# Altium schematic sheet GSM-LCD-ATmega32.schdoc: GSM-LCD-ATmega32
size A3; Address1: Remote control; Address2: Arduino compatible; Revision: 1.0; SheetNumber: 01; SheetTotal: 01
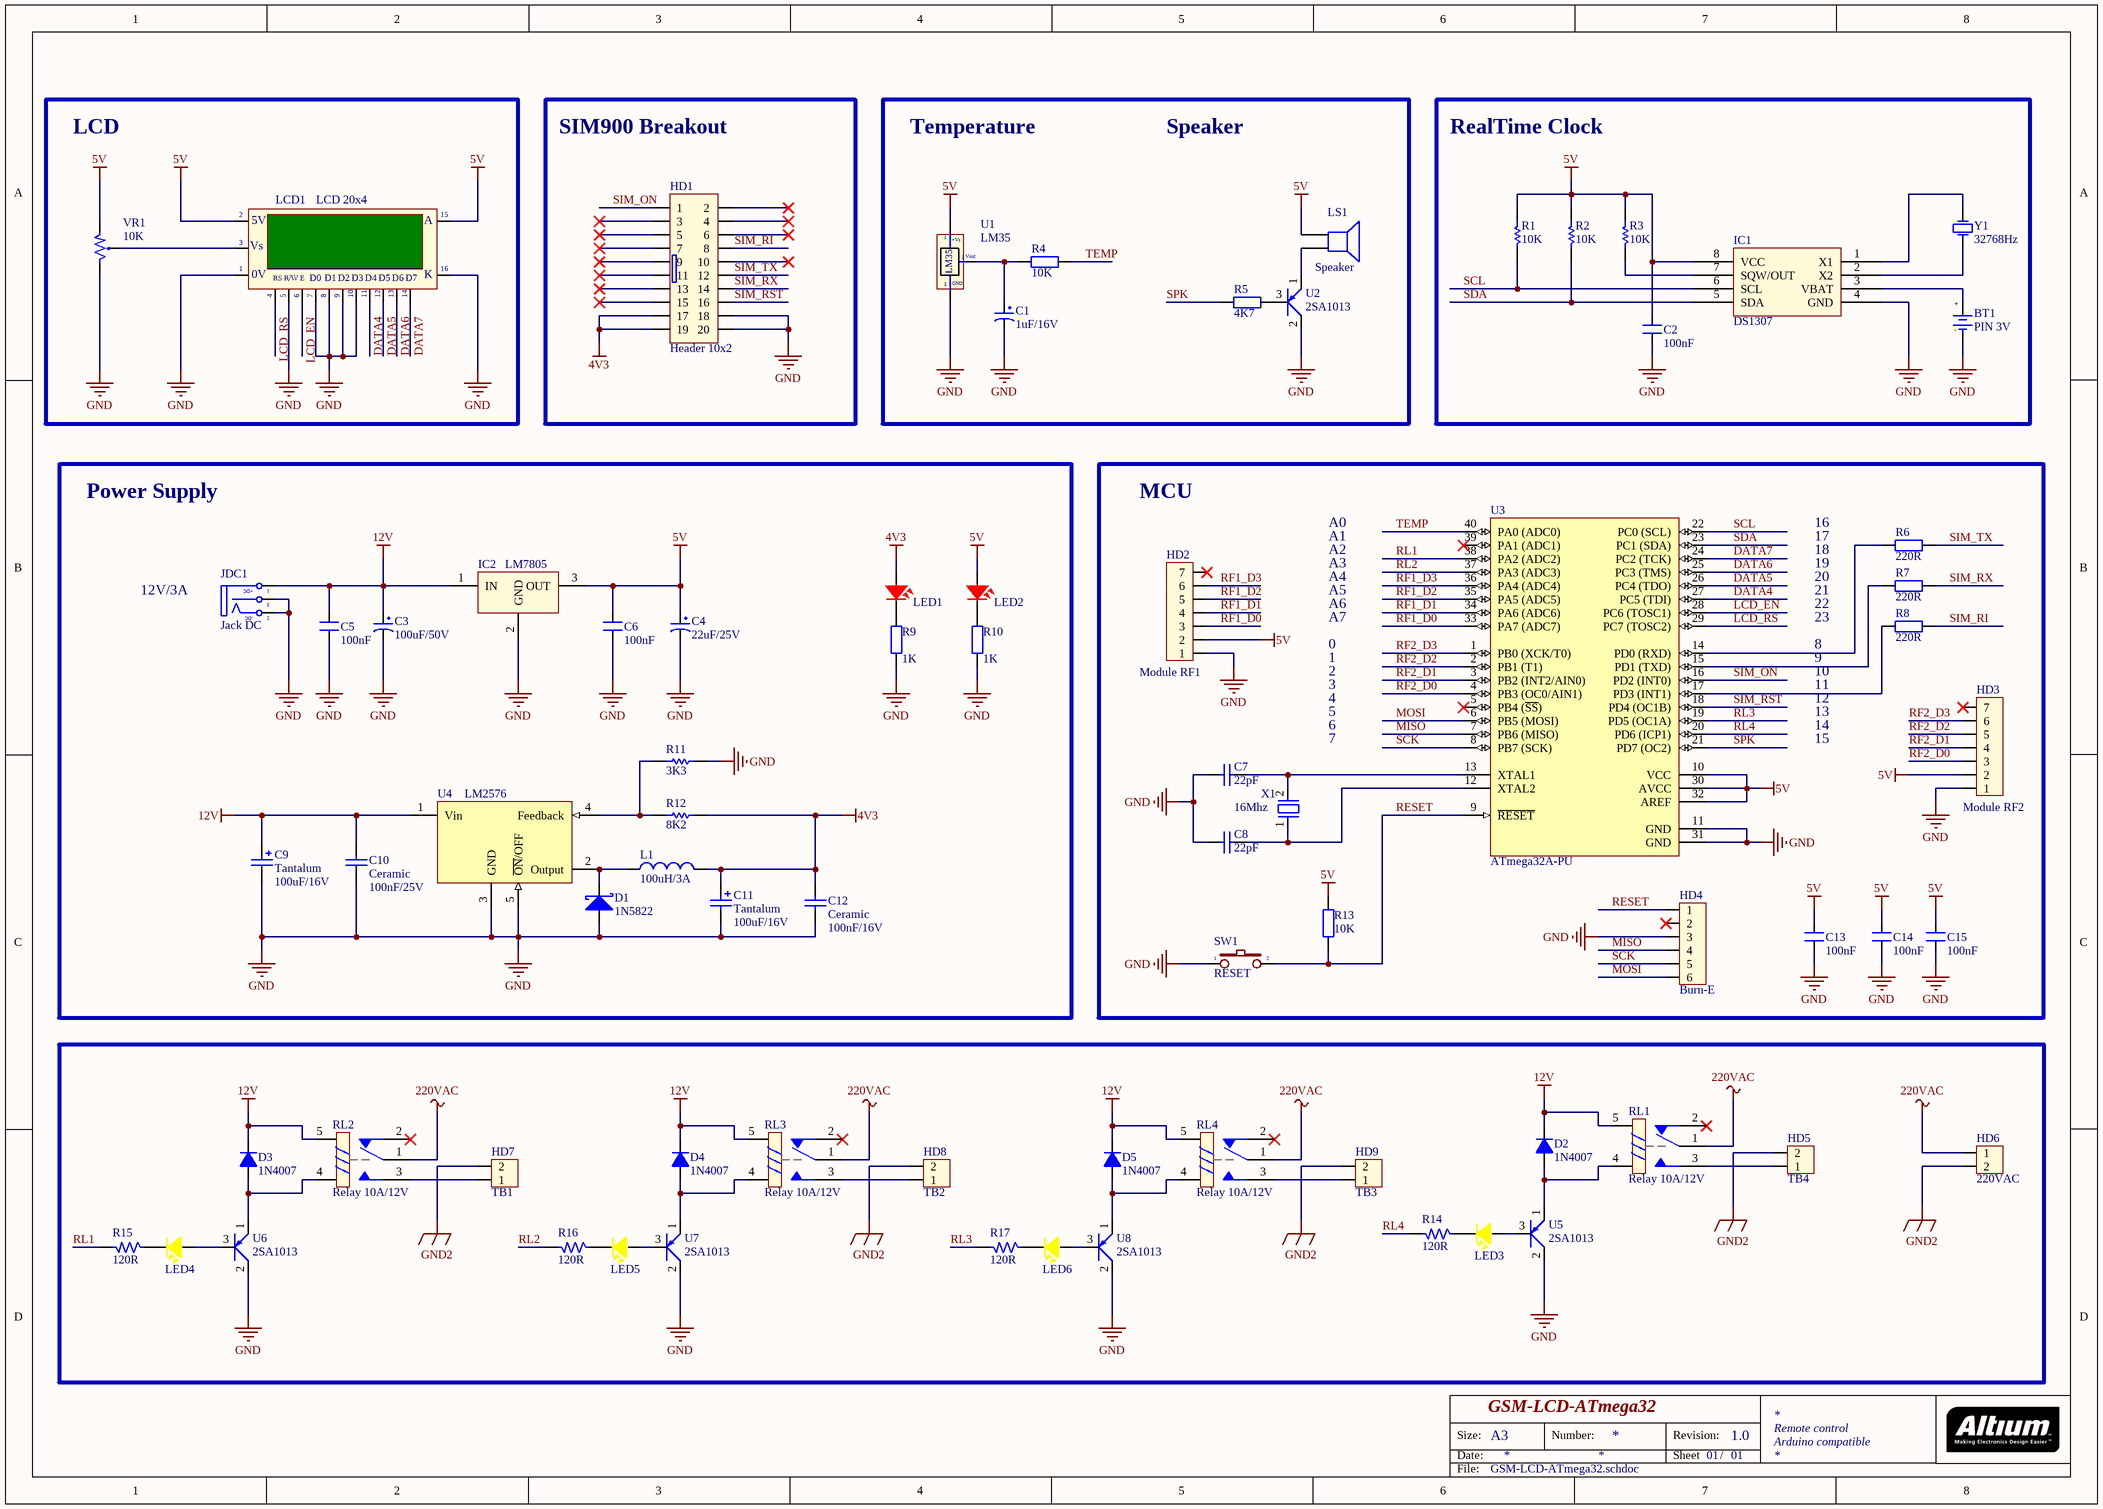
[diagram p0: GSM-LCD-ATmega32.schdoc]

## Parts
BT1  PIN 3V  [PIN3V]
C1  1uF/16V  [CAP_1UF_50V]
C2  100nF  [Tu gom 104]
C3  100uF/50V  [CAP_100UF_50V]
C4  22uF/25V  [CAP_22UF_50V]
C5  100nF  [Tu gom 104]
C6  100nF  [Tu gom 104]
C7  value 22pF  [Tu 33p]  (hidden comment: 5AK102KABAA)
C8  value 22pF  [Tu 33p]  (hidden comment: 5AK102KABAA)
C9  Tantalum  value 100uF/16V  [CAP_100UF_16V]
C10  Ceramic  value 100nF/25V  [Tu gom 104]
C11  Tantalum  value 100uF/16V  [CAP_100UF_16V]
C12  Ceramic  value 100nF/16V  [Tu gom 104]
C13  100nF  [Tu gom 104]
C14  100nF  [Tu gom 104]
C15  100nF  [Tu gom 104]
D1  1N5822  [1N5822]
D2  1N4007  [1N4007]
D3  1N4007  [1N4007]
D4  1N4007  [1N4007]
D5  1N4007  [1N4007]
HD1  Header 10x2  [Female Header_10x2]
HD2  Module RF1  [FM-Header 7]
HD3  Module RF2  [FM-Header 7]
HD4  Burn-E  [CON6]
HD5  TB4  [DOMINO 2_pitch 8.5mm]
HD6  220VAC  [DOMINO 2_pitch 8.5mm]
HD7  TB1  [DOMINO 2_pitch 8.5mm]
HD8  TB2  [DOMINO 2_pitch 8.5mm]
HD9  TB3  [DOMINO 2_pitch 8.5mm]
IC1  DS1307  [DS1307]
IC2  LM7805  [LM7805_TN_S]
JDC1  Jack DC  [JACK DC-IN]
L1  value 100uH/3A  [Inductor 150mH]  (hidden comment: LD26W8-151N)
LCD1  LCD 20x4  [LCD20x4]
LED1  LED-RED  [LED3R]  (value not drawn)
LED2  LED-RED  [LED3R]  (value not drawn)
LED3  LED-YELLOW  [LED3Y]  (value not drawn)
LED4  LED-YELLOW  [LED3Y]  (value not drawn)
LED5  LED-YELLOW  [LED3Y]  (value not drawn)
LED6  LED-YELLOW  [LED3Y]  (value not drawn)
LS1  Speaker  [SPEAKER]
R1  value 10K  [RES 1/4W CFR25]
R2  value 10K  [RES 1/4W CFR25]
R3  value 10K  [RES 1/4W CFR25]
R4  value 10K  [RES 1/4W CFR25]  (hidden comment: Res2)
R5  value 4K7  [RES 1/4W CFR25]  (hidden comment: Res2)
R6  value 220R  [RES 1/4W CFR25]  (hidden comment: Res2)
R7  value 220R  [RES 1/4W CFR25]  (hidden comment: Res2)
R8  value 220R  [RES 1/4W CFR25]  (hidden comment: Res2)
R9  value 1K  [RES 1/4W CFR25]  (hidden comment: Res2)
R10  value 1K  [RES 1/4W CFR25]  (hidden comment: Res2)
R11  value 3K3  [RES 1/4W CFR25]  (hidden comment: CFR25S)
R12  value 8K2  [RES 1/4W CFR25]  (hidden comment: CFR25S)
R13  value 10K  [RES 1/4W CFR25]  (hidden comment: Res2)
R14  120R  [RES 1/4W CFR25]
R15  120R  [RES 1/4W CFR25]
R16  120R  [RES 1/4W CFR25]
R17  120R  [RES 1/4W CFR25]
RL1  Relay 10A/12V  [RL_10A_12V]
RL2  Relay 10A/12V  [RL_10A_12V]
RL3  Relay 10A/12V  [RL_10A_12V]
RL4  Relay 10A/12V  [RL_10A_12V]
SW1  RESET  [BUTTON 2PIN TRON]
U1  LM35  [LM35]
U2  2SA1013  [2SA1013]
U3  ATmega32A-PU  [ATmega32A]
U4  LM2576  [LM2576_DIP]
U5  2SA1013  [2SA1013]
U6  2SA1013  [2SA1013]
U7  2SA1013  [2SA1013]
U8  2SA1013  [2SA1013]
VR1  10K  [VR1]
X1  16Mhz  [CRYSTAL 16Mhz]
Y1  value 32768Hz  [Crystal 32.768 Khz_stand]  (hidden comment: HC49S-20-C-30-30-F-20.000MHz)

## Blocks framed on the sheet
LCD: LCD1 VR1
SIM900 Breakout: HD1
RealTime Clock: BT1 C2 IC1 R1-R3 Y1
Power Supply: C3-C6 C9-C12 D1 IC2 JDC1 L1 LED1 LED2 R9-R12 U4
MCU: C7 C8 C13-C15 HD2-HD4 R6-R8 R13 SW1 U3 X1

## Nets
4V3: C11.1(+) C12.2 HD1.17 HD1.19 L1.2 LED1.1 R12.1
5V: C2.2 C4.1 C6.2 C13.2 C14.2 C15.2 HD2.2 HD3.2 IC1.8(VCC) IC2.3(OUT) LCD1.2(VDD) LCD1.15(A) LED2.1 LS1.2 R1.2 R2.2 R3.2 R13.2 U1.1(+Vs) U3.10(VCC) U3.30(AVCC) U3.32(AREF) VR1.1
12V: C3.1 C5.2 C9.1(+) C10.2 D2.2(K) D3.2(K) D4.2(K) D5.2(K) IC2.1(IN) JDC1.1(T) RL1.5 RL2.5 RL3.5 RL4.5 U4.1(Vin)
220VAC: HD6.1 RL1.1 RL2.1 RL3.1 RL4.1
GND: BT1.2(GND) C1.2 C2.1 C3.2 C4.2 C5.1 C6.1 C7.1 C8.1 C9.2(-) C10.1 C11.2(-) C12.1 C13.1 C14.1 C15.1 D1.1(A) HD1.18 HD1.20 HD2.1 HD3.1 HD4.3 IC1.4(GND) IC2.2(GND) JDC1.2(TN) JDC1.3(S) LCD1.1(GND) LCD1.5(R/~{W}) LCD1.7(D0) LCD1.8(D1) LCD1.9(D2) LCD1.10(D3) LCD1.16(K) R9.1 R10.1 R11.2 SW1.1 U1.3(-) U2.2(C) U3.11(GND) U3.31(GND) U4.3(GND) U4.5(~{ON}/OFF) U5.2(C) U6.2(C) U7.2(C) U8.2(C) VR1.3
GND2: HD5.2 HD6.2 HD7.2 HD8.2 HD9.2
DATA4: LCD1.11(D4) U3.27(PC5_(TDI))
DATA5: LCD1.12(D5) U3.26(PC4_(TDO))
DATA6: LCD1.13(D6) U3.25(PC3_(TMS))
DATA7: LCD1.14(D7) U3.24(PC2_(TCK))
LCD_EN: LCD1.6(~{EN}) U3.28(PC6_(TOSC1))
LCD_RS: LCD1.4(RS) U3.29(PC7_(TOSC2))
MISO: HD4.4 U3.7(PB6_(MISO))
MOSI: HD4.6 U3.6(PB5_(MOSI))
RESET: HD4.1 R13.1 SW1.2 U3.9(~{RESET})
RF1_D0: HD2.3 U3.33(PA7_(ADC7))
RF1_D1: HD2.4 U3.34(PA6_(ADC6))
RF1_D2: HD2.5 U3.35(PA5_(ADC5))
RF1_D3: HD2.6 U3.36(PA4_(ADC4))
RF2_D0: HD3.3 U3.4(PB3_(OC0/AIN1))
RF2_D1: HD3.4 U3.3(PB2_(INT2/AIN0))
RF2_D2: HD3.5 U3.2(PB1_(T1))
RF2_D3: HD3.6 U3.1(PB0_(XCK/T0))
RL1: R15.2 U3.38(PA2_(ADC2))
RL2: R16.2 U3.37(PA3_(ADC3))
RL3: R17.2 U3.19(PD5_(OC1A))
RL4: R14.2 U3.20(PD6_(ICP1))
SCK: HD4.5 U3.8(PB7_(SCK))
SCL: IC1.6(SCL) R1.1 U3.22(PC0_(SCL))
SDA: IC1.5(SDA) R2.1 U3.23(PC1_(SDA))
SIM_ON: HD1.1 U3.16(PD2_(INT0))
SIM_RI: HD1.8 R8.2
SIM_RST: HD1.16 U3.18(PD4_(OC1B))
SIM_RX: HD1.14 R7.2
SIM_TX: HD1.12 R6.2
SPK: R5.1 U3.21(PD7_(OC2))
TEMP: R4.2 U3.40(PA0_(ADC0))
NetBT1_1: BT1.1(+3V) IC1.3(VBAT)
NetC1_1: C1.1 R4.1 U1.2(Vout)
NetC7_2: C7.2 U3.13(XTAL1) X1.2
NetC8_2: C8.2 U3.12(XTAL2) X1.1
NetD1_2: D1.2(K) L1.1 U4.2(Output)
NetD2_1: D2.1(A) RL1.4 U5.1(E)
NetD3_1: D3.1(A) RL2.4 U6.1(E)
NetD4_1: D4.1(A) RL3.4 U7.1(E)
NetD5_1: D5.1(A) RL4.4 U8.1(E)
NetHD5_1: HD5.1 RL1.3
NetHD7_1: HD7.1 RL2.3
NetHD8_1: HD8.1 RL3.3
NetHD9_1: HD9.1 RL4.3
NetIC1_1: IC1.1(X1) Y1.2(OSC2)
NetIC1_2: IC1.2(X2) Y1.1(OSC1)
NetIC1_7: IC1.7(SQW/OUT) R3.1
NetLCD1_3: LCD1.3(VEE) VR1.2
NetLED1_2: LED1.2 R9.2
NetLED2_2: LED2.2 R10.2
NetLED3_1: LED3.1 U5.3(B)
NetLED3_2: LED3.2 R14.1
NetLED4_1: LED4.1 U6.3(B)
NetLED4_2: LED4.2 R15.1
NetLED5_1: LED5.1 U7.3(B)
NetLED5_2: LED5.2 R16.1
NetLED6_1: LED6.1 U8.3(B)
NetLED6_2: LED6.2 R17.1
NetLS1_1: LS1.1 U2.1(E)
NetR5_2: R5.2 U2.3(B)
NetR6_1: R6.1 U3.14(PD0_(RXD))
NetR7_1: R7.1 U3.15(PD1_(TXD))
NetR8_1: R8.1 U3.17(PD3_(INT1))
NetR11_1: R11.1 R12.2 U4.4(Feedback)

Not connected (* = marked no-connect by the designer): HD1 2* 3* 4* 5* 6* 7* 9* 10* 11* 13* 15*; HD2 7*; HD3 7*; HD4 2*; RL1 2*; RL2 2*; RL3 2*; RL4 2*; U3 5(PB4_(~{SS}))* 39(PA1_(ADC1))*; X1 3(GND)

## Notes on the sheet
- Temperature
- Speaker
- A0
- A1
- A2
- A3
- A4
- 16
- 17
- 18
- 19
- 20
- 12V/3A
- 0
- A5
- A6
- A7
- 8
- 21
- 22
- 23
- 1
- 2
- 3
- 4
- 5
- 9
- 10
- 11
- 12
- 13
- 6
- 7
- 14
- 15
- Size:
- Date:
- Number:
- Revision:
- Sheet
- /
- File:
- (in symbol DCIN) +DC; -DC
- (in symbol LCD16x2A) 5V; Vs; |; 0V; R/W; E
- (in symbol LM35) GND
- (in symbol PIN 3V) +; -

## Library data of the parts
BT1 = PIN 3V: Battery 3VDC; Value: PIN 3V
C1 C3 C4 = CP3: Cap 100uF/35V - 470uF/16V; Value: 100uF/35V/50V; Description 1: 1000uF/6,3V - 470uF/16V - 330uF - 25V; Description 2: 220uF/35V - 100uF/50V - 63V - 4,7uF/200V; Description 3: 22uF => 33uF100V - 3,3uF => 4,7uF/250V; Description 4: 2,2uF =>3,3uF/350 - 2,2uF/400V - 1uF/450V
C2 C5 C6 C13-C15 = CN2: Cap np 104 => 105pF; Value: 0.1uF
C7 C8 = 5AK102KABAA: CAP NPO CAPNTO 1nF 100V 10%; ComponentLink1Description: Datasheet; ComponentLink1URL: D:\Dropbox\Datasheets\Passive Components\Capacitors\AVX Disc Ceramic Capacitors.pdf; Unit Price: 0.003
C9 C11 = Cap Pol2: Tantalum Capacitor; Supplier: http://thegioiic.com/products/tajc107k016rnj
C10 C12 = Cap Cera: CeramicCapacitor, 16V, 2.54mm
D1 = 1N5822: Schottky Rectifier, 40V-3A; Note: Terminal 2 is the TAB and is electrically connected to the cathode; Published: 8-Jun-2000; LatestRevisionDate: 17-Jul-2002; LatestRevisionNote: Re-released for DXP Platform.; DatasheetVersion: Dec-1997; PackageVersion: Feb-1998; PackageReference: TO-220AC; Publisher: Altium Limited; PackageDescription: TO, Thru-Hole, Vertical, Heatsink Mounted; 3 In-Line Leads (1 Absent); Pitch 2.54 mm; ComponentLink1Description: Manufacturer Link; ComponentLink1URL: http://www.irf.com/; ComponentLink2Description: Datasheet; ComponentLink2URL: http://www.irf.com/product-info/datasheets/data/18tq.pdf
D2-D5 = D1A: Diode 1A; Value: 1N4007
HD1 = HED10X2: Value: Header 5x2
HD2 HD3 = Hed7: Header 7; Value: Header 5
HD4 = Hed6: Header 6 (Trang); Value: Header 6 (Trang)
HD5-HD9 = Hed2: Domino 2; Value: Domino 2
IC1 = DS1307: Serial, I2C Real-Time Clock
IC2 = LM78xx: On ap +, from + 5 to + 24VDC; Value: LM7805
JDC1 = DCIN: Jac DC input; Value: Jac DC
L1 = Inductor: Code_IEC: 1005; Published: 8-Jun-2000; LatestRevisionDate: 29-May-2009; LatestRevisionNote: IPC-7351 Footprint Added.; PackageReference: 0402-A; Publisher: Altium Limited; PackageDescription: Chip Inductor; Code_JEITA: 0402
LCD1 = LCD16x2A: LCD dipslay 20 char, 4 line; Value: LCD 20x4
LED1 LED2 = LED-RED: LED Single; Value: RED
LED3-LED6 = LED-YELLOW: LED Single; Value: YELLOW
LS1 = Speaker: Loudspeaker; Published: 24-Mar-1999; LatestRevisionDate: 17-Jul-2002; LatestRevisionNote: Re-released for DXP Platform.; PackageReference: PIN2; Publisher: Altium Limited
R1-R3 = CF1/4W1KJ25
R4-R10 R13 = Res2: Resistor; Published: 8-Jun-2000; LatestRevisionDate: 17-Jul-2002; LatestRevisionNote: Re-released for DXP Platform.; PackageReference: AXIAL-0.4; Publisher: Altium Limited; PackageDescription: Axial Device, Thru-Hole; 2 Leads; 0.4 in Pin Spacing
R11 R12 = Res1: Resistor 1/4W, AXIAL-0.3
R14-R17 = R: Resistor 1/4W; Value: R1/4W - 1K
RL1-RL4 = Relay 1: Relay SPDT,10A - 12VDC 5 Pin; Value: Relay SPDT, 10A, 12V
SW1 = SW2: Switch button 2 pin; Value: SW chip 2 pin
U1 = LM35: Teminal; Value: LM35
U2 U5-U8 = 2SA1013: PNP Epitaxial Silicon Transistor
U3 = ATmega32A-PU: 8-bit AVR Microcontroller, 32KB Flash, 1KB EEPROM, 2KB SRAM, 40-pin PDIP, Industrial Grade (-40°C to 85°C); Published: 1-Apr-2010; DatasheetVersion: revB, Jul-2009; PackageVersion: revB, Sep-2001; PackageReference: 40P6; Publisher: Altium Limited; PackageDescription: 40-lead (0.600"/15.24mm Wide) Plastic Dual Inline Package (PDIP); Supplier 1: Digi-Key; Supplier Part Number 1: ATMEGA32A-PU-ND; Supplier 2: Farnell; Supplier Part Number 2: 1704565; Supplier 3: Mouser; Supplier Part Number 3: 556-ATMEGA32A-PU; Code_JEDEC: MS-011-AC; ComponentLink1Description: Manufacturer Link; ComponentLink1URL: http://www.atmel.com/products/avr/default.asp?; ComponentLink2Description: ATmega32A Datasheet; ComponentLink2URL: http://www.atmel.com/dyn/resources/prod_documents/doc8155.pdf; ComponentLink3Description: ATmega32A Summary; ComponentLink3URL: http://www.atmel.com/dyn/resources/prod_documents/8155S.pdf; ComponentLink4Description: Atmel.com Home; ComponentLink4URL: http://www.atmel.com
U4 = LM2576: 3.0 A, 15 V, Step-Down  Switching Regulator
VR1 = VR1: Var Resistor; Value: VR 10K
X1 = XT2: Crystal For all Crystal 2pin.; Value: 4Mhz
Y1 = HC49S-20-C-30-30-F-20.000MHz: Crystal Oscillator 30ppm 20.000MHz; ComponentLink1Description: Datasheet; ComponentLink1URL: D:\Dropbox\Datasheets\Passive Components\Crystals\HC49S.pdf; Unit Price: 0.0440